# Altium schematic sheet ADC.SchDoc
size A3
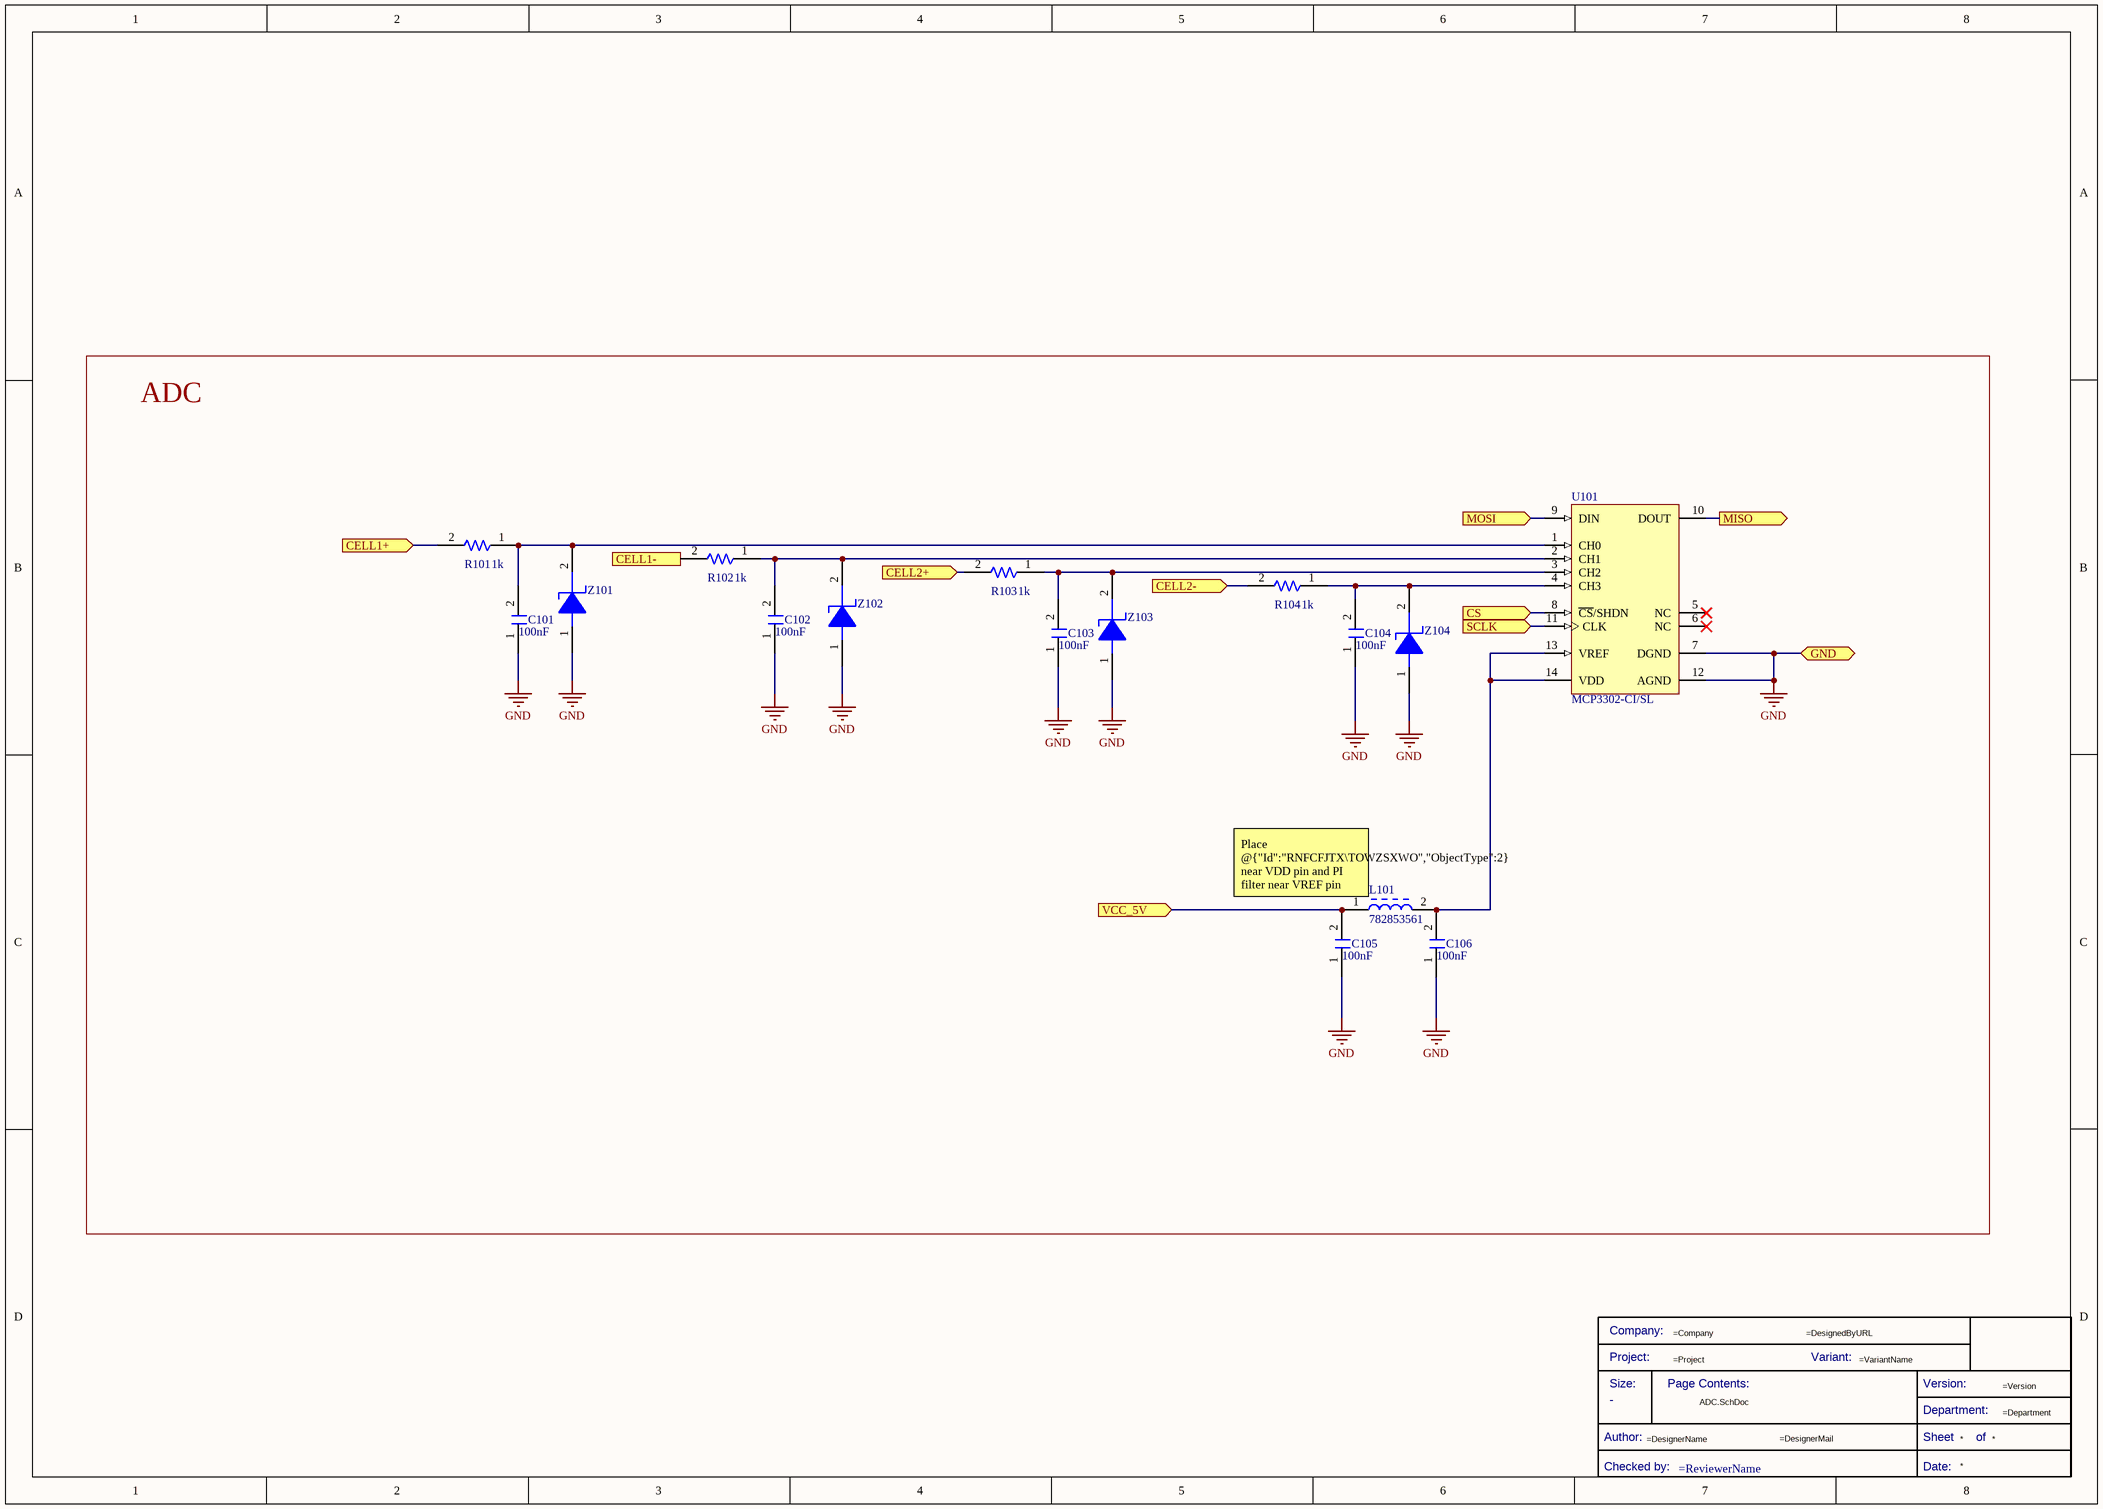
[diagram p0: ADC.SchDoc]

## Parts
*  Title Block_template  (value not drawn)  (graphical)
C101  value 100nF  [C0805FNPC-R]  (hidden comment: C100n-50V-0805FNPC-X7R)
C102  value 100nF  [C0805FNPC-R]  (hidden comment: C100n-50V-0805FNPC-X7R)
C103  value 100nF  [C0805FNPC-R]  (hidden comment: C100n-50V-0805FNPC-X7R)
C104  value 100nF  [C0805FNPC-R]  (hidden comment: C100n-50V-0805FNPC-X7R)
C105  value 100nF  [C0805FNPC-R]  (hidden comment: C100n-50V-0805FNPC-X7R)
C106  value 100nF  [C0805FNPC-R]  (hidden comment: C100n-50V-0805FNPC-X7R)
L101  782853561  [L_Ferrite_bead_0805]
R101  value 1k  [0805]  (hidden comment: R1K_0805_0.125W)
R102  value 1k  [0805]  (hidden comment: R1K_0805_0.125W)
R103  value 1k  [0805]  (hidden comment: R1K_0805_0.125W)
R104  value 1k  [0805]  (hidden comment: R1K_0805_0.125W)
U101  MCP3302-CI/SL  [SOIC-SL14_L]
Z101  BZD27B5V1P-M3-08  [SODFL370X108-2N]  (value not drawn)
Z102  BZD27B5V1P-M3-08  [SODFL370X108-2N]  (value not drawn)
Z103  BZD27B5V1P-M3-08  [SODFL370X108-2N]  (value not drawn)
Z104  BZD27B5V1P-M3-08  [SODFL370X108-2N]  (value not drawn)

## Blocks framed on the sheet
ADC: C101-C106 L101 R101-R104 U101 Z101-Z104

## Ports
CELL1+ (in), CELL1- (in), CELL2+ (in), CELL2- (in), CS (in), GND (bidir), MISO (out), MOSI (in), SCLK (in), VCC_5V (in)

## Nets
GND: C101.1 C102.1 C103.1 C104.1 C105.1 C106.1 U101.7(DGND) U101.12(AGND) Z101.1 Z102.1 Z103.1 Z104.1 ; port GND
CELL1+: R101.2 ; port CELL1+
CELL1-: R102.2 ; port CELL1-
CELL2+: R103.2 ; port CELL2+
CELL2-: R104.2 ; port CELL2-
CS: U101.8(~{CS}/SHDN) ; port CS
MISO: U101.10(DOUT) ; port MISO
MOSI: U101.9(DIN) ; port MOSI
SCLK: U101.11(CLK) ; port SCLK
VCC_5V: C105.2 L101.1 ; port VCC_5V
NetC101_2: C101.2 R101.1 U101.1(CH0) Z101.2
NetC102_2: C102.2 R102.1 U101.2(CH1) Z102.2
NetC103_2: C103.2 R103.1 U101.3(CH2) Z103.2
NetC104_2: C104.2 R104.1 U101.4(CH3) Z104.2
NetC106_2: C106.2 L101.2 U101.13(VREF) U101.14(VDD)

Not connected (* = marked no-connect by the designer): U101 5(NC)* 6(NC)*

## Notes on the sheet
- (near L101) Place @{"Id":"RNFCFJTX\TOWZSXWO","ObjectType":2} near VDD pin and PI filter near VREF pin
- (in symbol Title Block_template) Company:; Project:; Variant:; Size:; Page Contents:; Version:; Department:; Author:; Sheet; of; Checked by:; Date:

## Library data of the parts
* = Title Block_template: Standard Title Block; .Creator: GP; Category: Title Block; .PCBcheck: GP; .SCHcheck: GP; Checked by:: =ReviewerName; Size: -
C101-C106 = CMP-00063-1: Cap, 0.1ΜF, 50V, 10%, X7R, 0805; Manufacturer 1: Wurth Electronics; Manufacturer Part Number 1: 885012207098; .Creator: DR; Pricing 1: 100=0,10200, 500=0,07100, 2000=0,06100 (GBP); ComponentLink1URL: http://www.farnell.com/datasheets/1958498.pdf?src-supplier=Farnell; Design Item ID: C100n-50V-0805FNPC-X7R; Voltage Rating (DC): 50V; Voltage Rating: 50V; Max Operating Temperature: 125°C; RoHS: Yes; Case Code (Metric): 2012; Mount: Surface Mount; REACH SVHC: Unknown; Stock 1: 8000; Source: Passives.SchLib; Tolerance: 10%; RoHS Compliant: Yes; Dielectric: X7R; ComponentLink2Description: http://www.farnell.com/datasheets/1958498.pdf?src-supplier=Element14; ComponentLink2URL: http://www.farnell.com/datasheets/1958498.pdf?src-supplier=Element14; Min Operating Temperature: -55°C; Width: 0.049inch; Category: Ceramic Capacitors; Thickness: 0.035inch; Length: 0.079inch; ComponentLink3URL: https://katalog.we-online.de/pbs/datasheet/885012207098.pdf?src-supplier=Digi-Key; Case/Package: 0805; ComponentLink3Description: https://katalog.we-online.de/pbs/datasheet/885012207098.pdf?src-supplier=Digi-Key; Packaging: Cut Tape; ComponentLink1Description: http://www.farnell.com/datasheets/1958498.pdf?src-supplier=Farnell; ComponentLink4Description: http://www.farnell.com/datasheets/1958498.pdf?src-supplier=Newark; ComponentLink4URL: http://www.farnell.com/datasheets/1958498.pdf?src-supplier=Newark
L101 = CMP-00166-1: Manufacturer Part Number: BLM18EG331TN1D; Manufacturer: Murata; .Creator: GP; Tolerance: 25%; Core Material: Ferrite; Impedance: 330R; Max DC Current: 500mA; Resistance: 0.21; Number of Circuits: 1; DC Resistance (DCR): 210mR; Material: Ferrite,Steel; Test Frequency: 100MHz; RoHS: Yes; Case Code (Metric): 1608; ComponentLink6URL: https://datasheet.ciiva.com/3082/l0110s0101blm18e-3082714.pdf?src-supplier=Avnet; ComponentLink7URL: https://datasheet.ciiva.com/6211/l0110s0101blm18e-6211470.pdf?src-supplier=Digi-Key; Width: 0.8mm; ComponentLink6Description: https://datasheet.ciiva.com/3082/l0110s0101blm18e-3082714.pdf?src-supplier=Avnet; Series: BLM18E; Stock 1: 20037; Packaging: Tape and Reel; Max Operating Temperature: 125°C; Case/Package: 0603; ComponentLink8URL: https://datasheet.ciiva.com/6211/l0110s0101blm18e-6211471.pdf?src-supplier=Digi-Key; Case Code (Imperial): 0603; Lead Free: Lead Free; ComponentLink3Description: https://datasheet.ciiva.com/41449/001172267-da-01-en-drossel-0603-330r-1-6x0-8mm-4000st-41449581.pdf?src-supplier=Conrad; Height: 0.8mm; REACH SVHC: No SVHC; ComponentLink1URL: https://datasheet.ciiva.com/1467/5169-1467232.pdf?src-supplier=Element14; Number of Pins: 2; Source: Filter components.SchLib; ComponentLink1Description: https://datasheet.ciiva.com/1467/5169-1467232.pdf?src-supplier=Element14; Depth: 0.8mm; Termination: SMD/SMT; Package Quantity: 1; Min Operating Temperature: -55°C; ComponentLink7Description: https://datasheet.ciiva.com/6211/l0110s0101blm18e-6211470.pdf?src-supplier=Digi-Key; Design Item ID: L_Ferrite_bead_782853561; Length: 1.6mm; ComponentLink4Description: https://datasheet.ciiva.com/1467/5169-1467233.pdf?src-supplier=Element14; ComponentLink8Description: https://datasheet.ciiva.com/6211/l0110s0101blm18e-6211471.pdf?src-supplier=Digi-Key; Current Rating: 500mA; RoHS Compliant: Yes; ComponentLink2Description: https://datasheet.ciiva.com/11795/0900766b811b5866-11795405.pdf?src-supplier=RSComponents; Number of Lines: 1; ComponentLink2URL: https://datasheet.ciiva.com/11795/0900766b811b5866-11795405.pdf?src-supplier=RSComponents; Pricing 1: 1=0,23000, 10=0,17500, 25=0,14520, 50=0,12520, 100=0,11260, 250=0,09508, 500=0,08508, 1000=0,07257 (USD); Max Current Rating: 500mA; ComponentLink5URL: https://datasheet.ciiva.com/1561/5169-1561345.pdf?src-supplier=Newark; ComponentLink4URL: https://datasheet.ciiva.com/1467/5169-1467233.pdf?src-supplier=Element14; Category: Ferrite Beads and Chips; ComponentLink3URL: https://datasheet.ciiva.com/41449/001172267-da-01-en-drossel-0603-330r-1-6x0-8mm-4000st-41449581.pdf?src-supplier=Conrad; ComponentLink5Description: https://datasheet.ciiva.com/1561/5169-1561345.pdf?src-supplier=Newark
R101-R104 = CMP-009-00019-4: Fixed Resistor, Thin Film, 0.125W, 1000ohm, 150V, 0.1% +/-Tol, 15ppm/Cel, Surface Mount, 0805; Power: 125mW; RoHS Compliant: Yes; Case/Package: 0805; Mounting Technology: Surface Mount; Min Operating Temperature: -55°C; Tolerance: 0.1%; Pins: 2; Max Operating Temperature: 125°C
U101 = CMP-031-00009-1: ADC, Successive Approximation, 13-Bit, 1 Func, 4 Channel, Serial Access, PDSO14; RoHS Compliant: Yes; Case/Package: SOP; Max Operating Temperature: 85°C; Min Operating Temperature: -40°C; Pins: 14
Z101-Z104 = CMP-004-00008-1: Zener Diode, 5.1V V(Z), 2%, 0.8W, Silicon, Unidirectional, DO-219AB; RoHS Compliant: Yes; Pins: 2; Max Operating Temperature: 175°C; Min Operating Temperature: -65°C